# EAGLE schematic jellyFish_schematic (EAGLE 9.6.2)
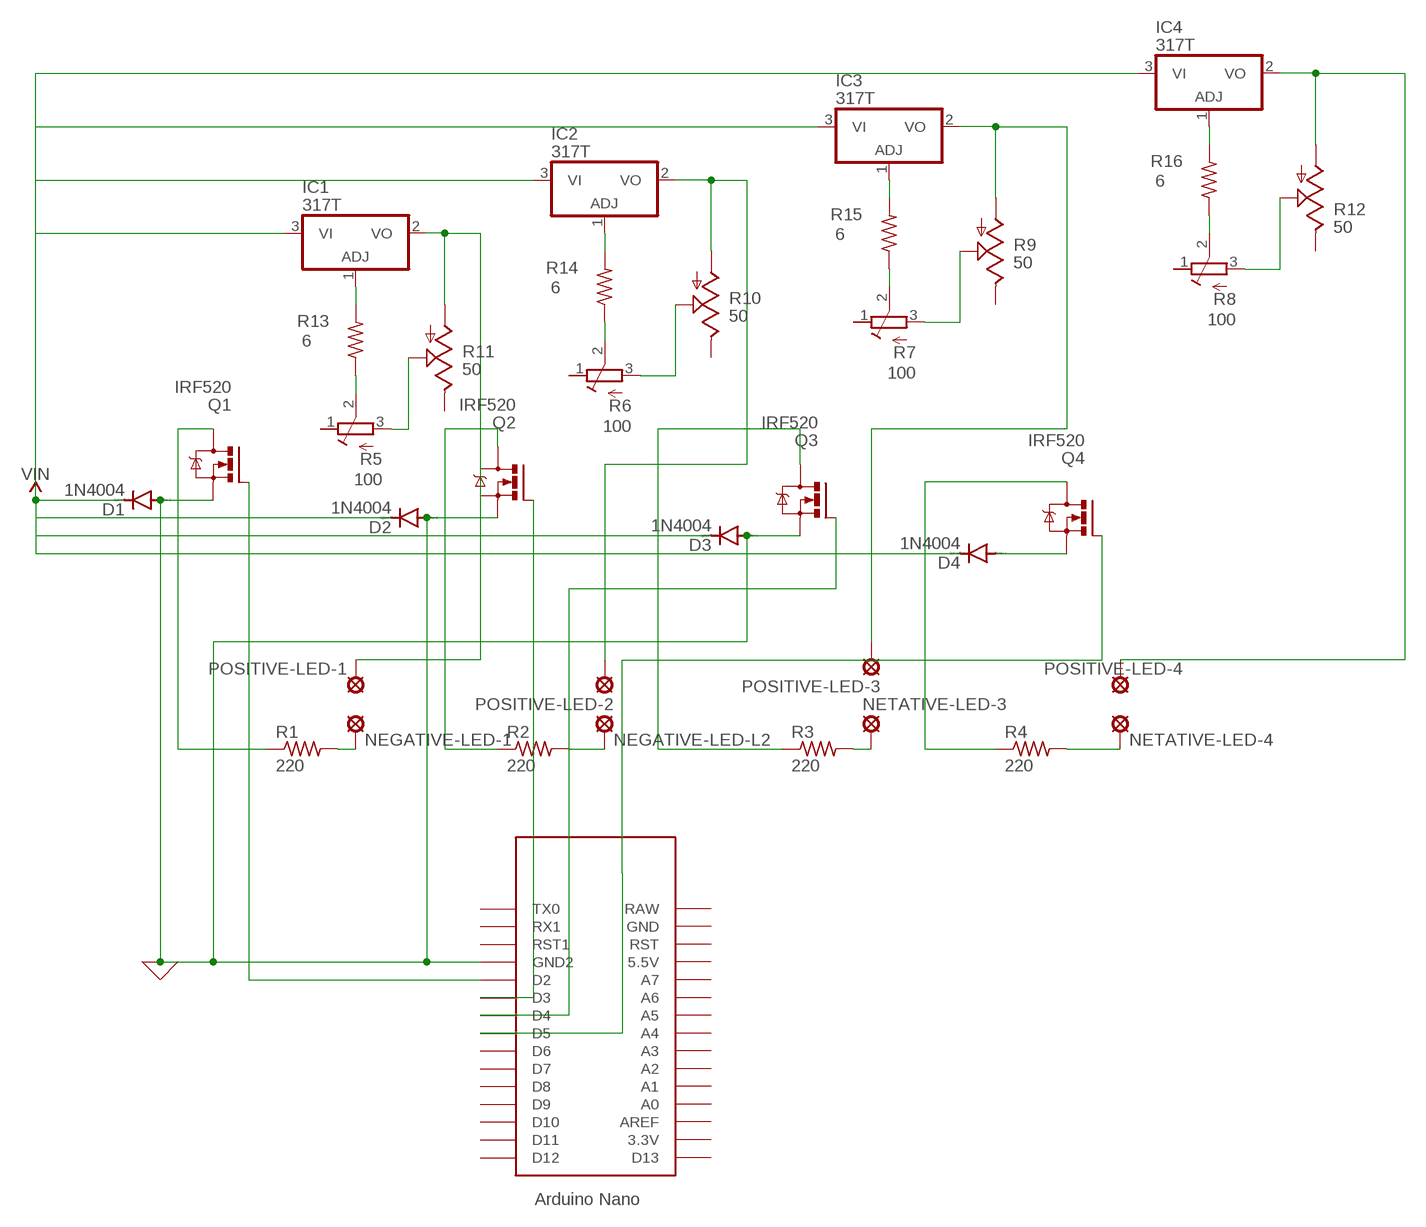
[diagram p0: schematic, sheet 1]

## Parts
D1  1N4004  [DO41-10]
D2  1N4004  [DO41-10]
D3  1N4004  [DO41-10]
D4  1N4004  [DO41-10]
IC1  317T  [TO220H]
IC2  317T  [TO220H]
IC3  317T  [TO220H]
IC4  317T  [TO220H]
NEGATIVE-LED-1  LSP10  [LSP10]
NEGATIVE-LED-L2  LSP10  [LSP10]
NETATIVE-LED-3  LSP10  [LSP10]
NETATIVE-LED-4  LSP10  [LSP10]
POSITIVE-LED-1  POSITIVE LED  LSP10  [LSP10]
POSITIVE-LED-2  LSP10  [LSP10]
POSITIVE-LED-3  LSP10  [LSP10]
POSITIVE-LED-4  LSP10  [LSP10]
Q1  IRF520  [TO220BV]
Q2  IRF520  [TO220BV]
Q3  IRF520  [TO220BV]
Q4  IRF520  [TO220BV]
R1  220  R-US_R0805  [R0805]
R2  220  R-US_R0805  [R0805]
R3  220  R-US_R0805  [R0805]
R4  220  R-US_R0805  [R0805]
R5  100  R-TRIMMT93YA  [RTRIMT93YA]
R6  100  R-TRIMMT93YA  [RTRIMT93YA]
R7  100  R-TRIMMT93YA  [RTRIMT93YA]
R8  100  R-TRIMMT93YA  [RTRIMT93YA]
R9  50  TRIM_US-S63P  [S63P]
R10  50  TRIM_US-S63P  [S63P]
R11  50  TRIM_US-S63P  [S63P]
R12  50  TRIM_US-S63P  [S63P]
R13  6  R-US_R0805  [R0805]
R14  6  R-US_R0805  [R0805]
R15  6  R-US_R0805  [R0805]
R16  6  R-US_R0805  [R0805]
U$1  NANO  [NANO]

## Nets
0: D1.A D2.A D3.A Q1.S Q2.S Q3.S U$1.GND1(GND2) ; supply symbol labelled GROUND
N$1: Q1.G U$1.D2
N$2: NEGATIVE-LED-1.MP R1.2
N$3: Q1.D R1.1
N$4: Q2.D R2.1
N$5: NEGATIVE-LED-L2.MP R2.2
N$6: Q2.G U$1.D3
N$7: Q3.D R3.1
N$8: Q3.G U$1.D4
N$9: NETATIVE-LED-3.MP R3.2
N$10: D4.A Q4.S
N$11: Q4.D R4.1
N$12: NETATIVE-LED-4.MP R4.2
N$13: IC1.1(ADJ) R13.2
N$14: Q4.G U$1.D5 U$1.ICSP1 U$1.ICSP2
N$15: R5.2(S) R13.1
N$16: R5.3(A) R11.S
N$17: IC1.2(VO) POSITIVE-LED-1.MP R11.A
N$18: IC2.1(ADJ) R14.2
N$19: R6.2(S) R14.1
N$20: R6.3(A) R10.S
N$21: IC2.2(VO) POSITIVE-LED-2.MP R10.A
N$22: IC3.1(ADJ) R15.2
N$23: R7.2(S) R15.1
N$24: R7.3(A) R9.S
N$25: IC3.2(VO) POSITIVE-LED-3.MP R9.A
N$26: IC4.1(ADJ) R16.2
N$27: R8.2(S) R16.1
N$28: R8.3(A) R12.S
N$29: IC4.2(VO) POSITIVE-LED-4.MP R12.A
VIN: D1.C D2.C D3.C D4.C IC1.3(VI) IC2.3(VI) IC3.3(VI) IC4.3(VI)
Unconnected: R5.1(E) R6.1(E) R7.1(E) R8.1(E) R9.E R10.E R11.E R12.E U$1.3.3V U$1.5V(5.5V) U$1.A0 U$1.A1 U$1.A2 U$1.A3 U$1.A4 U$1.A5 U$1.A6 U$1.A7 U$1.AREF U$1.D6 U$1.D7 U$1.D8 U$1.D9 U$1.D10 U$1.D11 U$1.D12 U$1.D13 U$1.GND U$1.ICSP3 U$1.ICSP4 U$1.ICSP5 U$1.ICSP6 U$1.RAW U$1.RST U$1.RST1 U$1.RX1 U$1.TX0

## Library data of the parts
D1-D4 = diode:1N4004: DIODE general purpose rectifier, 1 A
IC1-IC4 = linear:*317: Positive VOLTAGE REGULATOR
NEGATIVE-LED-1 NEGATIVE-LED-L2 NETATIVE-LED-3 NETATIVE-LED-4 POSITIVE-LED-1-POSITIVE-LED-4 = solpad:LSP10: SOLDER PAD drill 1.0 mm, distributor Buerklin, 12H555
Q1-Q4 = transistor-power:IRF520: HEXFET Power MOSFET
R1-R4 R13-R16 = rcl:R-US_: RESISTOR, American symbol; SPICEPREFIX: R
R5-R8 = rcl:R-TRIMM: Trimm resistor; SPICEMODEL: X; SPICEPREFIXL: POT
R9-R12 = pot:TRIM_US-: POTENTIOMETER
U$1 = Arduino-clone:NANO: Arduino Nano